# EAGLE schematic reflip_1.3 (EAGLE 8.7.0)
TITLE: LP-REFLIP 1.0-DK; VERSION: 1.3

## Sheet 1 of 2
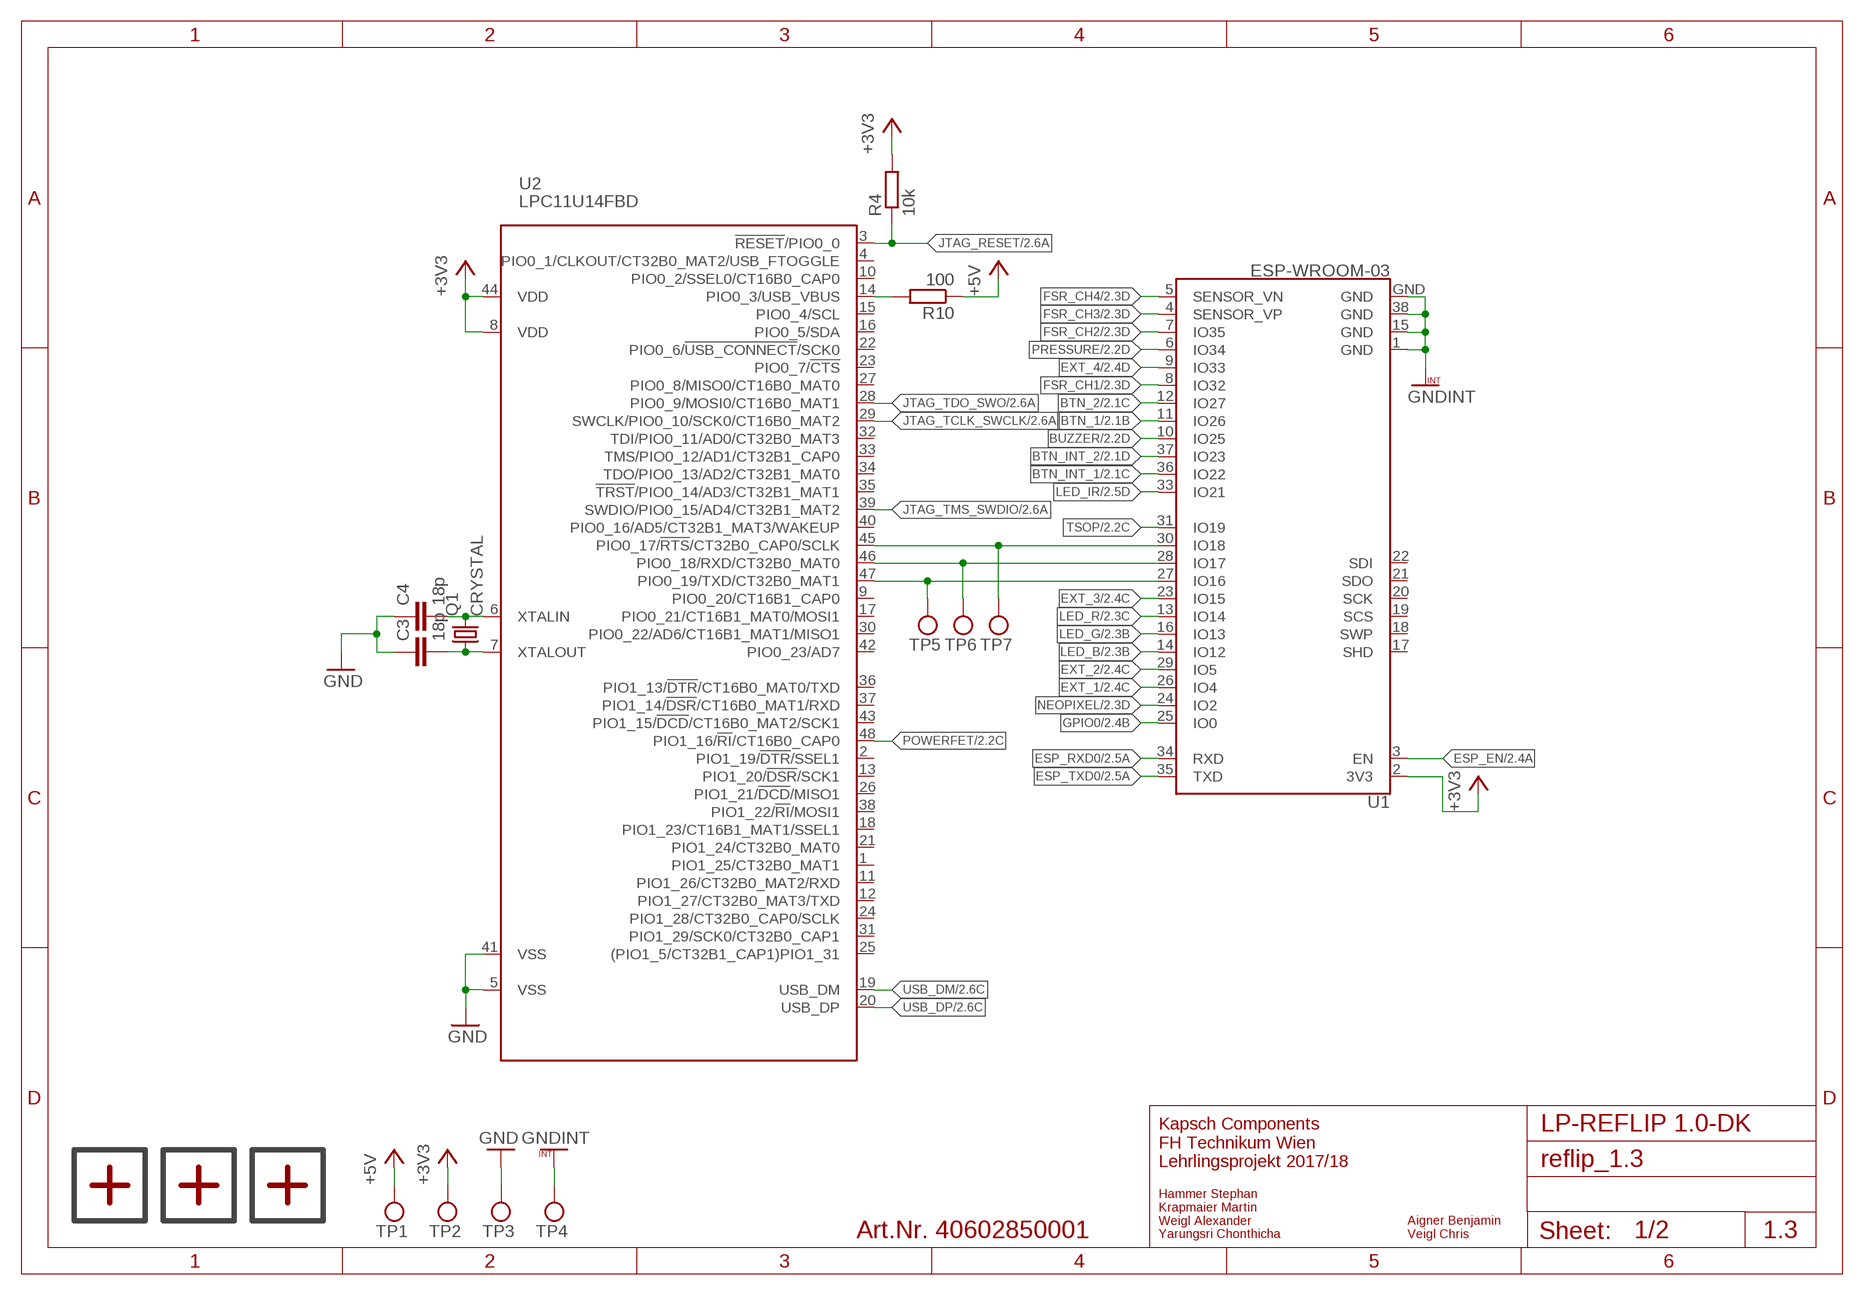
[diagram p0: schematic, sheet 1]

### Parts
C3  18p  C-EUC0603  [C0603]
C4  18p  C-EUC0603  [C0603]
Q1  CRYSTAL  [CRYSTAL]
R4  10k  R-EU_R0603  [R0603]
R10  100  R-EU_R0603  [R0603]
U1  ESP-WROOM-03  [ESP-WROOM-03]
U2  LPC11U14FBD  [SOT313-2]
U$3  PASSMARKE  [PASSMARKE]
U$4  PASSMARKE  [PASSMARKE]
U$5  PASSMARKE  [PASSMARKE]
U$6  TP1  TESTPUNKT  [TESTPUNKT]
U$7  TP2  TESTPUNKT  [TESTPUNKT]
U$8  TP3  TESTPUNKT  [TESTPUNKT]
U$9  TP4  TESTPUNKT  [TESTPUNKT]
U$10  TP7  TESTPUNKT  [TESTPUNKT]
U$11  TP6  TESTPUNKT  [TESTPUNKT]
U$12  TP5  TESTPUNKT  [TESTPUNKT]

### Nets
+3V3: R4.2 U1.2(3V3) U2.8(VDD) U2.44(VDD) U$7.P$1(VCC) ; also sheet 2
+5V: R10.1 U$6.P$1(VCC) ; also sheet 2
BTN_1: U1.11(IO26) ; also sheet 2
BTN_2: U1.12(IO27) ; also sheet 2
BTN_INT_1: U1.36(IO22) ; also sheet 2
BTN_INT_2: U1.37(IO23) ; also sheet 2
BUZZER: U1.10(IO25) ; also sheet 2
ESP_EN: U1.3(EN) ; also sheet 2
ESP_RXD0: U1.34(RXD) ; also sheet 2
ESP_TXD0: U1.35(TXD) ; also sheet 2
EXT_1: U1.26(IO4) ; also sheet 2
EXT_2: U1.29(IO5) ; also sheet 2
EXT_3: U1.23(IO15) ; also sheet 2
EXT_4: U1.9(IO33) ; also sheet 2
FSR_CH1: U1.8(IO32) ; also sheet 2
FSR_CH2: U1.7(IO35) ; also sheet 2
FSR_CH3: U1.4(SENSOR_VP) ; also sheet 2
FSR_CH4: U1.5(SENSOR_VN) ; also sheet 2
GND: C3.1 C4.1 U2.5(VSS) U2.41(VSS) U$8.P$1(VCC) ; also sheet 2
GNDINT: U1.1(GND) U1.15(GND) U1.38(GND) U1.GND U$9.P$1(VCC) ; also sheet 2
GPIO0: U1.25(IO0) ; also sheet 2
JTAG_RESET: R4.1 U2.3(!RESET!/PIO0_0) ; also sheet 2
JTAG_TCLK_SWCLK: U2.29(SWCLK/PIO0_10/SCK0/CT16B0_MAT2) ; also sheet 2
JTAG_TDO_SWO: U2.28(PIO0_9/MOSI0/CT16B0_MAT1) ; also sheet 2
JTAG_TMS_SWDIO: U2.39(SWDIO/PIO0_15/AD4/CT32B1_MAT2) ; also sheet 2
LED_B: U1.14(IO12) ; also sheet 2
LED_G: U1.16(IO13) ; also sheet 2
LED_IR: U1.33(IO21) ; also sheet 2
LED_R: U1.13(IO14) ; also sheet 2
LPC_RXD: U1.28(IO17) U2.46(PIO0_18/RXD/CT32B0_MAT0) U$11.P$1(VCC)
LPC_SIG: U1.30(IO18) U2.45(PIO0_17/!RTS!/CT32B0_CAP0/SCLK) U$10.P$1(VCC)
LPC_TXD: U1.27(IO16) U2.47(PIO0_19/TXD/CT32B0_MAT1) U$12.P$1(VCC)
N$11: C4.2 Q1.P$2 U2.6(XTALIN)
N$20: R10.2 U2.14(PIO0_3/USB_VBUS)
N$23: C3.2 Q1.P$1 U2.7(XTALOUT)
NEOPIXEL: U1.24(IO2) ; also sheet 2
POWERFET: U2.48(PIO1_16/!RI!/CT16B0_CAP0) ; also sheet 2
PRESSURE: U1.6(IO34) ; also sheet 2
TSOP: U1.31(IO19) ; also sheet 2
USB_DM: U2.19(USB_DM) ; also sheet 2
USB_DP: U2.20(USB_DP) ; also sheet 2
Unconnected: U1.17(SHD) U1.18(SWP) U1.19(SCS) U1.20(SCK) U1.21(SDO) U1.22(SDI) U2.1(PIO1_25/CT32B0_MAT1) U2.2(PIO1_19/!DTR!/SSEL1) U2.4(PIO0_1/CLKOUT/CT32B0_MAT2/USB_FTOGGLE) U2.9(PIO0_20/CT16B1_CAP0) U2.10(PIO0_2/SSEL0/CT16B0_CAP0) U2.11(PIO1_26/CT32B0_MAT2/RXD) U2.12(PIO1_27/CT32B0_MAT3/TXD) U2.13(PIO1_20/!DSR!/SCK1) U2.15(PIO0_4/SCL) U2.16(PIO0_5/SDA) U2.17(PIO0_21/CT16B1_MAT0/MOSI1) U2.18(PIO1_23/CT16B1_MAT1/SSEL1) U2.21(PIO1_24/CT32B0_MAT0) U2.22(PIO0_6/!USB_CONNECT!/SCK0) U2.23(PIO0_7/!CTS!) U2.24(PIO1_28/CT32B0_CAP0/SCLK) U2.25((PIO1_5/CT32B1_CAP1)PIO1_31) U2.26(PIO1_21/!DCD!/MISO1) U2.27(PIO0_8/MISO0/CT16B0_MAT0) U2.30(PIO0_22/AD6/CT16B1_MAT1/MISO1) U2.31(PIO1_29/SCK0/CT32B0_CAP1) U2.32(TDI/PIO0_11/AD0/CT32B0_MAT3) U2.33(TMS/PIO0_12/AD1/CT32B1_CAP0) U2.34(TDO/PIO0_13/AD2/CT32B1_MAT0) U2.35(!TRST!/PIO0_14/AD3/CT32B1_MAT1) U2.36(PIO1_13/!DTR!/CT16B0_MAT0/TXD) U2.37(PIO1_14/!DSR!/CT16B0_MAT1/RXD) U2.38(PIO1_22/!RI!/MOSI1) U2.40(PIO0_16/AD5/CT32B1_MAT3/WAKEUP) U2.42(PIO0_23/AD7) U2.43(PIO1_15/!DCD!/CT16B0_MAT2/SCK1)

### Notes on the sheet
- Kapsch Components
  FH Technikum Wien
  Lehrlingsprojekt 2017/18
- Art.Nr. 40602850001
- Hammer Stephan
  Krapmaier Martin
  Weigl Alexander
  Yarungsri Chonthicha
- Aigner Benjamin
  Veigl Chris

## Sheet 2 of 2
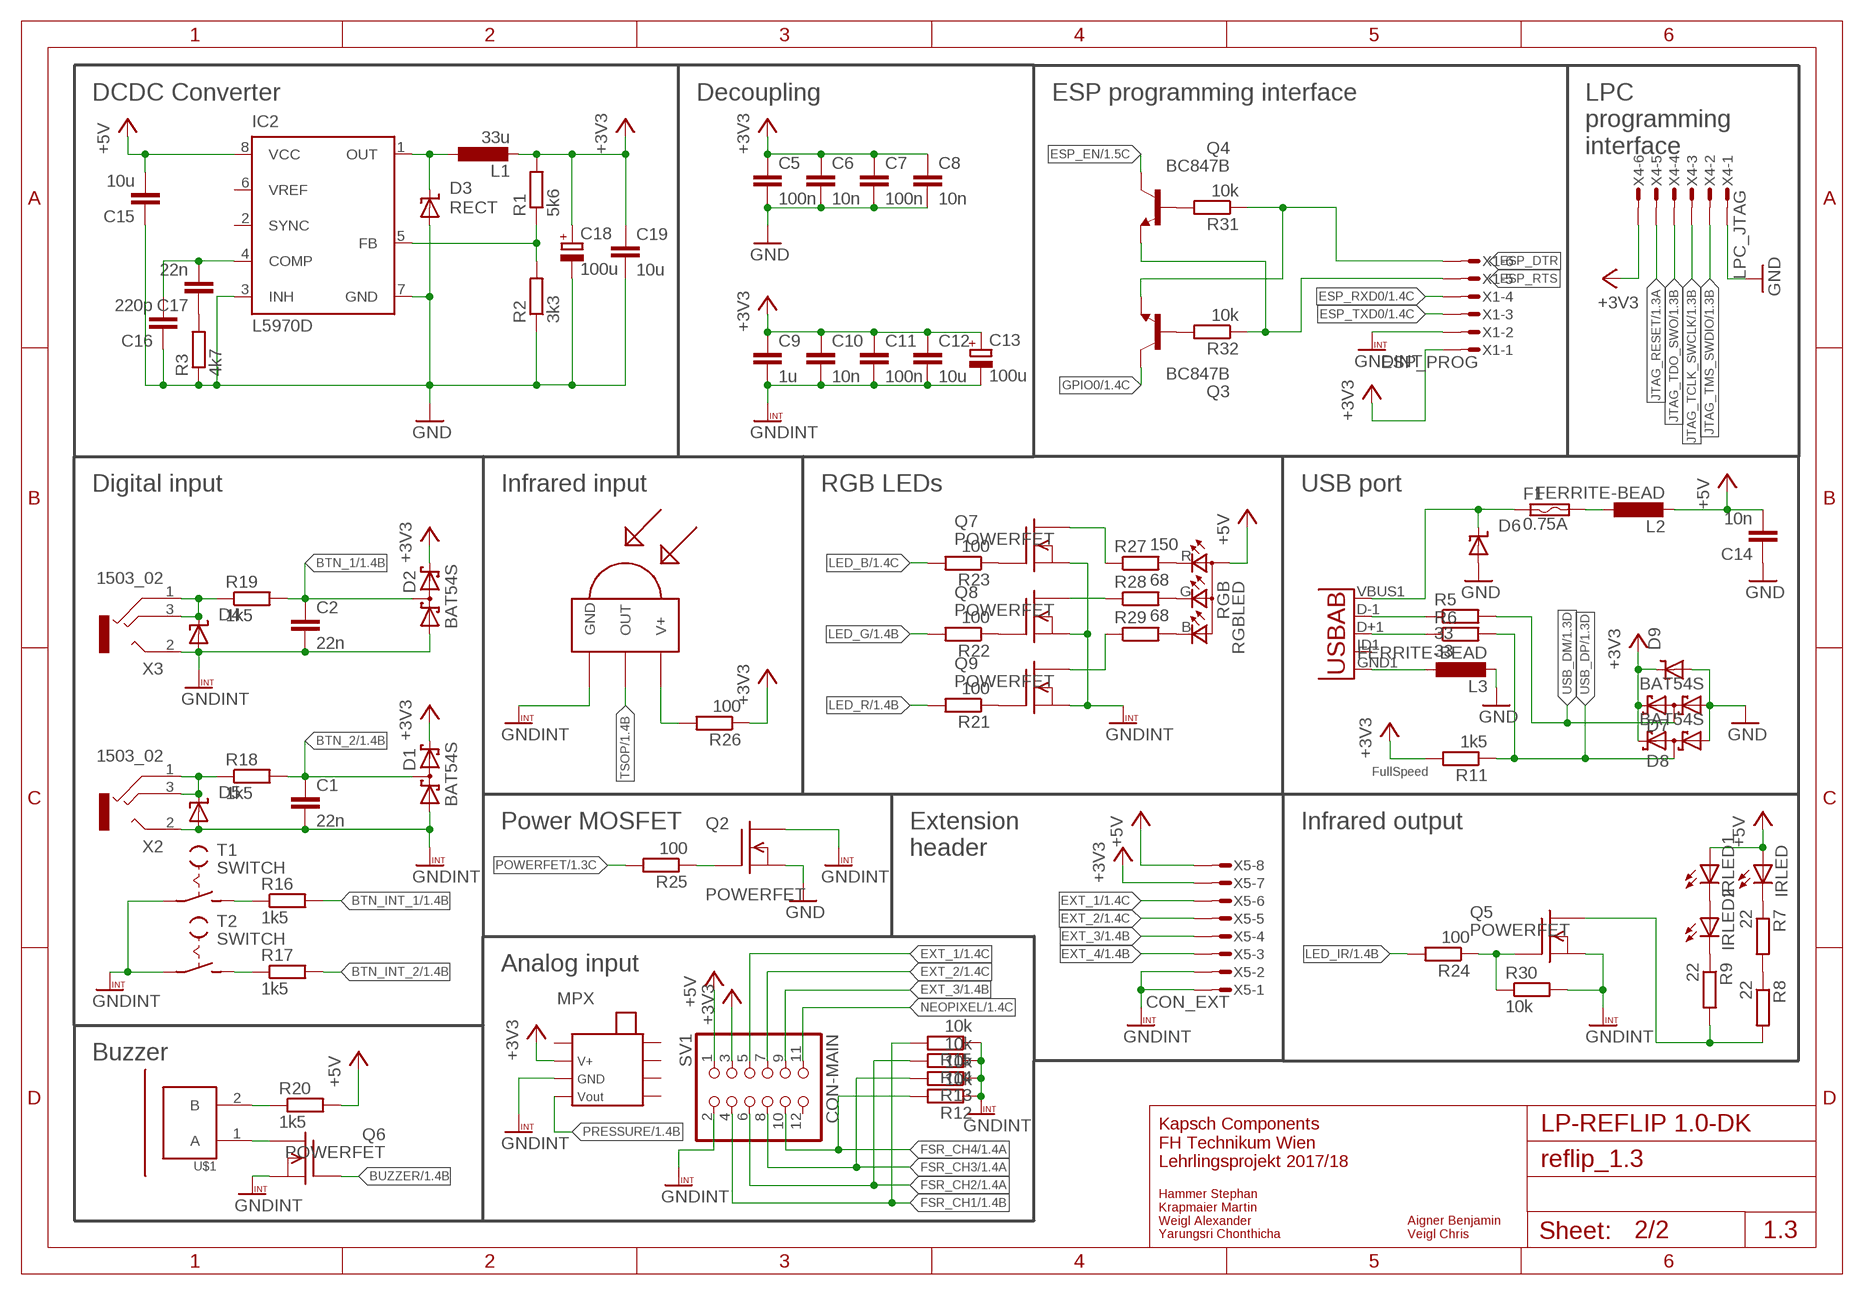
[diagram p1: schematic, sheet 2]

### Parts
C1  22n  C-EUC0603  [C0603]
C2  22n  C-EUC0603  [C0603]
C5  100n  C-EUC0603  [C0603]
C6  10n  C-EUC0603  [C0603]
C7  100n  C-EUC0603  [C0603]
C8  10n  C-EUC0603  [C0603]
C9  1u  C-EUC0603  [C0603]
C10  10n  C-EUC0603  [C0603]
C11  100n  C-EUC0603  [C0603]
C12  10u  C-EUC0603  [C0603]
C13  100u  CPOL-EUD  [PANASONIC_D]
C14  10n  C-EUC0603  [C0603]
C15  10u  C-EUC0603  [C0603]
C16  220p  C-EUC0603  [C0603]
C17  22n  C-EUC0603  [C0603]
C18  100u  CPOL-EUD  [PANASONIC_D]
C19  10u  C-EUC0603  [C0603]
D1  BAT54S  [SOT23]
D2  BAT54S  [SOT23]
D3  RECT  [SMBJ]
D4  TVS-DIODE  [SMBJ]
D5  TVS-DIODE  [SMBJ]
D6  TVS-DIODE  [SMBJ]
D7  BAT54S  [SOT23]
D8  BAT54S  [SOT23]
D9  TVS-DIODE  [SMBJ]
F1  0.75A  FUSE  [FUSE]
IC2  L5970D  L5973D  [HSOP8]
IRLED  IRLED  [IRLED]
IRLED1  IRLED  [IRLED]
IRLED2  IRLED  [IRLED]
L1  33u  SPULE  [SPULE]
L2  FERRITE-BEAD  [FERRITEBEAD]
L3  FERRITE-BEAD  [FERRITEBEAD]
MPX  MPX_PRESSURE_SENSOR  [MPX_PRESSURE_SENSOR]
Q2  POWERFET  [SOT-23]
Q3  BC847B  [SOT23]
Q4  BC847B  [SOT23]
Q5  POWERFET  [SOT-23]
Q6  POWERFET  [SOT-23]
Q7  POWERFET  [SOT-23]
Q8  POWERFET  [SOT-23]
Q9  POWERFET  [SOT-23]
R1  5k6  R-EU_R0603  [R0603]
R2  3k3  R-EU_R0603  [R0603]
R3  4k7  R-EU_R0603  [R0603]
R5  33  R-EU_R0603  [R0603]
R6  33  R-EU_R0603  [R0603]
R7  22  R-EU_R1206  [R1206]
R8  22  R-EU_R1206  [R1206]
R9  22  R-EU_R1206  [R1206]
R11  1k5  R-EU_R0603  [R0603]
R12  10k  R-EU_R0603  [R0603]
R13  10k  R-EU_R0603  [R0603]
R14  10k  R-EU_R0603  [R0603]
R15  10k  R-EU_R0603  [R0603]
R16  1k5  R-EU_R0603  [R0603]
R17  1k5  R-EU_R0603  [R0603]
R18  1k5  R-EU_R0603  [R0603]
R19  1k5  R-EU_R0603  [R0603]
R20  1k5  R-EU_R0603  [R0603]
R21  100  R-EU_R0603  [R0603]
R22  100  R-EU_R0603  [R0603]
R23  100  R-EU_R0603  [R0603]
R24  100  R-EU_R0603  [R0603]
R25  100  R-EU_R0603  [R0603]
R26  100  R-EU_R0603  [R0603]
R27  150  R-EU_R0603  [R0603]
R28  68  R-EU_R0603  [R0603]
R29  68  R-EU_R0603  [R0603]
R30  10k  R-EU_R0603  [R0603]
R31  10k  R-EU_R0603  [R0603]
R32  10k  R-EU_R0603  [R0603]
RGB  RGBLED  [RGBLED]
SV1  CON-MAIN  [FE06-2W]
T1  SWITCH  [SWITCHES]
T2  SWITCH  [SWITCHES]
U3  USB""  [USB-MICRO-SMD]
U$1  PKLCS1212E2400-R1  [BUZZ_PIEZO_SMD]
U$2  TSOP4838  [TSOP18XX]
X1  ESP_PROG  MICROMATCH-6SMD  [MICROMATCH-6SMD]
X2  1503_02  [1503_02]
X3  1503_02  [1503_02]
X4  LPC_JTAG  MICROMATCH-6SMD  [MICROMATCH-6SMD]
X5  CON_EXT  MICROMATCH-8SMD  [MICROMATCH-8-SMD]

### Nets
+3V3: C5.1 C6.1 C7.1 C8.1 C9.1 C10.1 C11.1 C12.1 C13.+ C18.+ C19.1 D1.2(C2) D2.2(C2) D7.2(C2) D8.2(C2) D9.C L1.P$2 MPX.P$2(V+) R1.2 R11.2 R26.1 SV1.3 X1.1 X4.6 X5.7 ; also sheet 1
+5V: C14.2 C15.2 IC2.8(VCC) IRLED1.A IRLED.A L2.P$2 R20.2 RGB.CA(A2) SV1.1 X5.8 ; also sheet 1
BTN_1: C2.1 D2.3(C1A2) R19.2 ; also sheet 1
BTN_2: C1.1 D1.3(C1A2) R18.2 ; also sheet 1
BTN_INT_1: R16.2 ; also sheet 1
BTN_INT_2: R17.2 ; also sheet 1
BUZZER: Q6.1(G) ; also sheet 1
ESP_DTR: Q3.2(E) R31.1 X1.6
ESP_EN: Q4.3(C) ; also sheet 1
ESP_RTS: Q4.2(E) R32.1 X1.5
ESP_RXD0: X1.4 ; also sheet 1
ESP_TXD0: X1.3 ; also sheet 1
EXT_1: SV1.5 X5.6 ; also sheet 1
EXT_2: SV1.7 X5.5 ; also sheet 1
EXT_3: SV1.9 X5.4 ; also sheet 1
EXT_4: X5.3 ; also sheet 1
FSR_CH1: R15.2 SV1.4 ; also sheet 1
FSR_CH2: R14.2 SV1.6 ; also sheet 1
FSR_CH3: R13.2 SV1.8 ; also sheet 1
FSR_CH4: R12.2 SV1.10 ; also sheet 1
GND: C5.2 C6.2 C7.2 C8.2 C14.1 C15.1 C16.1 C18.- C19.2 D3.A D6.A D7.1(A1) D8.1(A1) D9.A IC2.3(INH) IC2.7(GND) L3.P$2 Q2.2(S) R2.1 R3.1 X4.1 ; also sheet 1
GNDINT: C1.2 C2.2 C9.2 C10.2 C11.2 C12.2 C13.- D1.1(A1) D2.1(A1) D4.A D5.A MPX.P$3(GND) Q2.3(D) Q5.2(S) Q6.2(S) Q7.2(S) Q8.2(S) Q9.2(S) R12.1 R13.1 R14.1 R15.1 R30.2 SV1.2 T1.P$3(P) T2.P$3(P) U$2.GND X1.2 X2.2 X3.2 X5.1 X5.2 ; also sheet 1
GPIO0: Q3.3(C) ; also sheet 1
JTAG_RESET: X4.5 ; also sheet 1
JTAG_TCLK_SWCLK: X4.3 ; also sheet 1
JTAG_TDO_SWO: X4.4 ; also sheet 1
JTAG_TMS_SWDIO: X4.2 ; also sheet 1
LED_B: R23.2 ; also sheet 1
LED_G: R22.2 ; also sheet 1
LED_IR: R24.2 ; also sheet 1
LED_R: R21.2 ; also sheet 1
N$1: IC2.5(FB) R1.1 R2.2
N$2: Q9.1(G) R21.1
N$3: D3.C IC2.1(OUT) L1.P$1
N$4: R6.1 U3.D+1(D+)
N$8: Q2.1(G) R25.1
N$9: R5.1 U3.D-1(D-)
N$10: C17.1 R3.2
N$12: IRLED1.C IRLED2.A
N$13: C16.2 C17.2 IC2.4(COMP)
N$14: Q8.1(G) R22.1
N$15: Q7.1(G) R23.1
N$16: Q7.3(D) R27.1
N$17: IRLED2.C R9.1
N$18: R7.2 R8.1
N$19: R27.2 RGB.R(CRED)
N$21: D6.C F1.P$1 U3.VBUS1(VBUS)
N$22: F1.P$2 L2.P$1
N$24: R17.1 T2.P$4(S)
N$25: R20.1 U$1.2(B)
N$26: D5.C R18.1 X2.1 X2.3
N$27: Q5.3(D) R8.2 R9.2
N$28: D4.C R19.1 X3.1 X3.3
N$29: Q6.3(D) U$1.1(A)
N$30: R28.2 RGB.G(CGREEN)
N$31: R26.2 U$2.VCC(V+)
N$32: L3.P$1 U3.GND1(GND)
N$34: R29.2 RGB.B(CBLUE)
N$35: Q9.3(D) R29.1
N$36: Q8.3(D) R28.1
N$43: Q5.1(G) R24.1 R30.1
N$45: IRLED.C R7.1
N$46: Q4.1(B) R31.2
N$47: Q3.1(B) R32.2
NEOPIXEL: SV1.11 ; also sheet 1
POWERFET: R25.2 ; also sheet 1
PRESSURE: MPX.P$4(VOUT) ; also sheet 1
T1: R16.1 T1.P$4(S)
TSOP: U$2.OUT ; also sheet 1
USB_DM: D7.3(C1A2) R5.2 ; also sheet 1
USB_DP: D8.3(C1A2) R6.2 R11.1 ; also sheet 1
Unconnected: IC2.2(SYNC) IC2.6(VREF) IC2.EXP MPX.P$1 MPX.P$5 MPX.P$6 MPX.P$7 MPX.P$8 SV1.12 U3.ID1(USBID) X2.2@2 X3.2@2

### Notes on the sheet
- DCDC Converter | Decoupling | ESP programming interface
- LPC
  programming
  interface
- Digital input | Infrared input | RGB LEDs | USB port
- FullSpeed
- Power MOSFET | Infrared output
- Extension
  header
- Analog input
- Buzzer
- Kapsch Components
  FH Technikum Wien
  Lehrlingsprojekt 2017/18
- Hammer Stephan
  Krapmaier Martin
  Weigl Alexander
  Yarungsri Chonthicha
- Aigner Benjamin
  Veigl Chris

## Library data of the parts
C1-C12 C14-C17 C19 = rcl:C-EU: CAPACITOR, European symbol; SPICEPREFIX: C
C13 C18 = rcl:CPOL-EU: POLARIZED CAPACITOR, European symbol; SPICEPREFIX: C
D1 D2 D7 D8 = diode:BAT54S: Schottky Diodes Pin connection corrected 2011-05-04 Source: Fairchild .. BAT54.pdf
D3 = 000_FlipMouse:RECT
D4-D6 D9 = 000_FlipMouse:TVS-DIODE
F1 = 000_FlipMouse:FUSE
IC2 = st-microelectronics:L5973D: 2.5 A switch step down switching regulator Source: Data sheet <http://www.st.com/internet/com/TECHNICAL_RESOURCES/TECHNICAL_LITERATURE/DATASHEET/CD00002851.pdf>; MF: STMICROELECTRONICS; MPN: L5973D; OC_FARNELL: 1077145
IRLED IRLED1 IRLED2 = 000_FlipMouse:IRLED
L1 = 000_FlipMouse:SPULE
L2 L3 = 000_FlipMouse:FERRITE-BEAD
MPX = 000_FlipMouse:MPX_PRESSURE_SENSOR
Q1 = 000_FlipMouse:CRYSTAL
Q2 Q5-Q9 = 000_FlipMouse:POWERFET
Q3 Q4 = nxp_60:BC847: 45 V, 100 mA NPN general-purpose transistors NPN general-purpose transistor AAL Eindhoven MK
R1-R32 = rcl:R-EU_: RESISTOR, European symbol; SPICEPREFIX: R
RGB = 000_FlipMouse:RGBLED
SV1 = 000_FlipMouse:CON-MAIN
T1 T2 = 000_FlipMouse:SWITCH
U1 = esp32:ESP-WROOM-03
U2 = nxp_60:LPC11U14: NXP Semiconductors Attention: Pin PIO1_5 is not available in the LQFP48 package, whereas PIO1_31 is not available in the TFBGA48 package! LPC11Uxx microcontrollers <http://ics.nxp.com/products/lpc1000/lpc11xx/> ARM 32-bit Cortex-M0 Microcontroller with MPU CPU clock up to 50MHz Up to 32KByte on-chip Flash ROM with In-System Programming (ISP) and In-Application Programming (IAP) via On-Chip Bootloader Up to 8KByte SRAM Nested Vectored Interrupt Controller Up to 2 SPI controllers USB 2.0 device controller USART with full Modem Interface and RS485 Support and ISO7816-3 support Fast Mode I2C-Bus 4 Timers with 4 capture channels and 13 output channels Watchdog (WDT) Sytem tick timer 10-bit ADC with 8 channels Power Management Unit (PMU) Brownout detection 12MHz internal RC oscillator Serial Wire Debug/Trace port Symbol copied from RH, package adapted to NXP spec (MK)
U3 = 000_FlipMouse:USB: This is a USB AB connector that is compatible with USB OTG. i.e. this connector can serve as a host or device
U$1 = muRata-piezo:PKLCS1212E2400-R1
U$2 = tsop:TSOP4838: IR Receiver and Demodulator
U$3-U$5 = 000_FlipMouse:PASSMARKE
U$6-U$12 = 000_FlipMouse:TESTPUNKT
X1 X4 = 000_Con-amp-micromatch:MICROMATCH-6: MicroMaTch 6 7-215464-6 / 0-215464-6 Drawing Number C-215464 DDEController.pdf
X2 X3 = con-lumberg:1503_02: Jack connectors according to JISC 6560, 3.5 mm Klinkeneinbaukupplung nach JISC 6560, 3,5 mm, 3-polig/stereo, abgewinkelte Ausführung, Surface-Mount-Technik (SMT) Source: http://www.lumberg.com/Produkte/PDFs/1503_02.pdf; OC_FARNELL: 1216979; OC_NEWARK: unknown
X5 = 000_Con-amp-micromatch:MICROMATCH-8: MicroMaTch 8 7-215464-8 / 0-215464-8 Drawing Number C-215464 DDEController.pdf